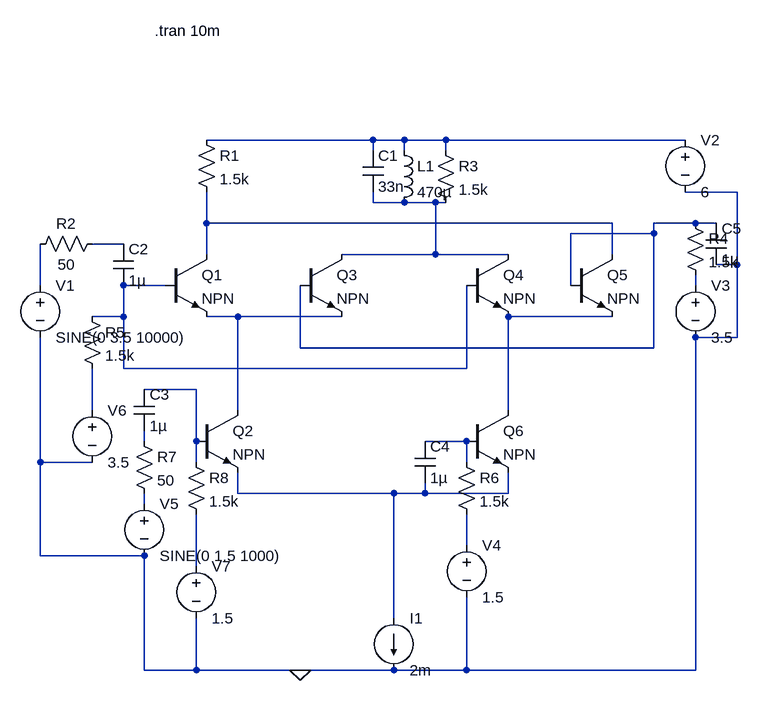
[diagram p0: schematic GilbertCell.asc]
GilbertCell.asc, the LTspice schematic file:
Version 4
SHEET 1 1416 896
WIRE 688 64 432 64
WIRE 736 64 688 64
WIRE 800 64 736 64
WIRE 1168 64 800 64
WIRE 688 80 688 64
WIRE 736 80 736 64
WIRE 800 80 800 64
WIRE 1248 144 1168 144
WIRE 688 160 688 144
WIRE 736 160 688 160
WIRE 784 160 736 160
WIRE 800 160 784 160
WIRE 432 192 432 144
WIRE 1056 192 432 192
WIRE 1184 192 1120 192
WIRE 1216 192 1184 192
WIRE 1120 208 1120 192
WIRE 1120 208 992 208
WIRE 304 224 256 224
WIRE 432 240 432 192
WIRE 784 240 784 160
WIRE 784 240 640 240
WIRE 896 240 784 240
WIRE 1056 240 1056 192
WIRE 1248 256 1248 144
WIRE 1248 256 1216 256
WIRE 176 288 176 224
WIRE 368 288 304 288
WIRE 992 288 992 208
WIRE 1184 288 1184 272
WIRE 304 336 304 288
WIRE 304 336 256 336
WIRE 480 336 432 336
WIRE 640 336 480 336
WIRE 1056 336 896 336
WIRE 1248 368 1248 256
WIRE 1248 368 1184 368
WIRE 576 384 576 288
WIRE 1120 384 1120 208
WIRE 1120 384 576 384
WIRE 304 416 304 336
WIRE 832 416 832 288
WIRE 832 416 304 416
WIRE 416 448 336 448
WIRE 256 480 256 416
WIRE 480 480 480 336
WIRE 896 480 896 336
WIRE 336 528 336 512
WIRE 416 528 416 448
WIRE 832 528 768 528
WIRE 176 560 176 368
WIRE 256 560 176 560
WIRE 416 560 416 528
WIRE 832 560 832 528
WIRE 480 608 480 576
WIRE 720 608 480 608
WIRE 768 608 768 592
WIRE 768 608 720 608
WIRE 896 608 896 576
WIRE 896 608 768 608
WIRE 336 624 336 608
WIRE 832 688 832 640
WIRE 176 704 176 560
WIRE 336 704 176 704
WIRE 416 720 416 640
WIRE 720 800 720 608
WIRE 336 880 336 704
WIRE 416 880 416 800
WIRE 416 880 336 880
WIRE 576 880 416 880
WIRE 720 880 576 880
WIRE 832 880 832 768
WIRE 832 880 720 880
WIRE 1184 880 1184 368
WIRE 1184 880 832 880
FLAG 576 880 0
SYMBOL voltage 176 272 R0
SYMATTR InstName V1
SYMATTR Value SINE(0 3.5 10000)
SYMBOL npn 368 240 R0
SYMATTR InstName Q1
SYMBOL npn 416 480 R0
SYMATTR InstName Q2
SYMBOL npn 576 240 R0
SYMATTR InstName Q3
SYMBOL npn 832 240 R0
SYMATTR InstName Q4
SYMBOL npn 992 240 R0
SYMATTR InstName Q5
SYMBOL npn 832 480 R0
SYMATTR InstName Q6
SYMBOL res 416 48 R0
SYMATTR InstName R1
SYMATTR Value 1.5k
SYMBOL voltage 1168 48 R0
SYMATTR InstName V2
SYMATTR Value 6
SYMBOL voltage 1184 272 R0
SYMATTR InstName V3
SYMATTR Value 3.5
SYMBOL voltage 832 672 R0
SYMATTR InstName V4
SYMATTR Value 1.5
SYMBOL voltage 336 608 R0
SYMATTR InstName V5
SYMATTR Value SINE(0 1.5 1000)
SYMBOL current 720 800 R0
SYMATTR InstName I1
SYMATTR Value 2m
SYMBOL cap 672 80 R0
SYMATTR InstName C1
SYMATTR Value 33n
SYMBOL ind 720 64 R0
SYMATTR InstName L1
SYMATTR Value 470µ
SYMBOL res 784 64 R0
SYMATTR InstName R3
SYMATTR Value 1.5k
SYMBOL res 272 208 R90
WINDOW 0 0 56 VBottom 2
WINDOW 3 32 56 VTop 2
SYMATTR InstName R2
SYMATTR Value 50
SYMBOL cap 288 224 R0
SYMATTR InstName C2
SYMATTR Value 1µ
SYMBOL res 1168 176 R0
SYMATTR InstName R4
SYMATTR Value 1.5k
SYMBOL voltage 256 464 R0
SYMATTR InstName V6
SYMATTR Value 3.5
SYMBOL res 240 320 R0
SYMATTR InstName R5
SYMATTR Value 1.5k
SYMBOL res 816 544 R0
SYMATTR InstName R6
SYMATTR Value 1.5k
SYMBOL res 320 512 R0
SYMATTR InstName R7
SYMATTR Value 50
SYMBOL cap 320 448 R0
SYMATTR InstName C3
SYMATTR Value 1µ
SYMBOL res 400 544 R0
SYMATTR InstName R8
SYMATTR Value 1.5k
SYMBOL voltage 416 704 R0
SYMATTR InstName V7
SYMATTR Value 1.5
SYMBOL cap 752 528 R0
SYMATTR InstName C4
SYMATTR Value 1µ
SYMBOL cap 1200 192 R0
SYMATTR InstName C5
SYMATTR Value 1µ
TEXT 352 -104 Left 2 !.tran 10m

The netlist it stands for:
* GilbertCell.asc
V1 N006 0 SINE(0 3.5 10000)
Q1 N003 N007 N009 0 NPN
Q2 N009 N011 N015 0 NPN
Q3 N002 N004 N009 0 NPN
Q4 N002 N007 N010 0 NPN
Q5 N003 N004 N010 0 NPN
Q6 N010 N014 N015 0 NPN
R1 N001 N003 1.5k
V2 N001 0 6
V3 N008 0 3.5
V4 N017 0 1.5
V5 N016 0 SINE(0 1.5 1000)
I1 N015 0 2m
C1 N001 N002 33n
L1 N001 N002 470µ
R3 N001 N002 1.5k
R2 N005 N006 50
C2 N005 N007 1µ
R4 N004 N008 1.5k
V6 N012 0 3.5
R5 N007 N012 1.5k
R6 N014 N017 1.5k
R7 N013 N016 50
C3 N011 N013 1µ
R8 N011 N018 1.5k
V7 N018 0 1.5
C4 N014 N015 1µ
C5 N004 0 1µ
.model NPN NPN
.model PNP PNP
.lib standard.bjt
.tran 10m
.backanno
.end